# Altium project B155AA.PrjPcb
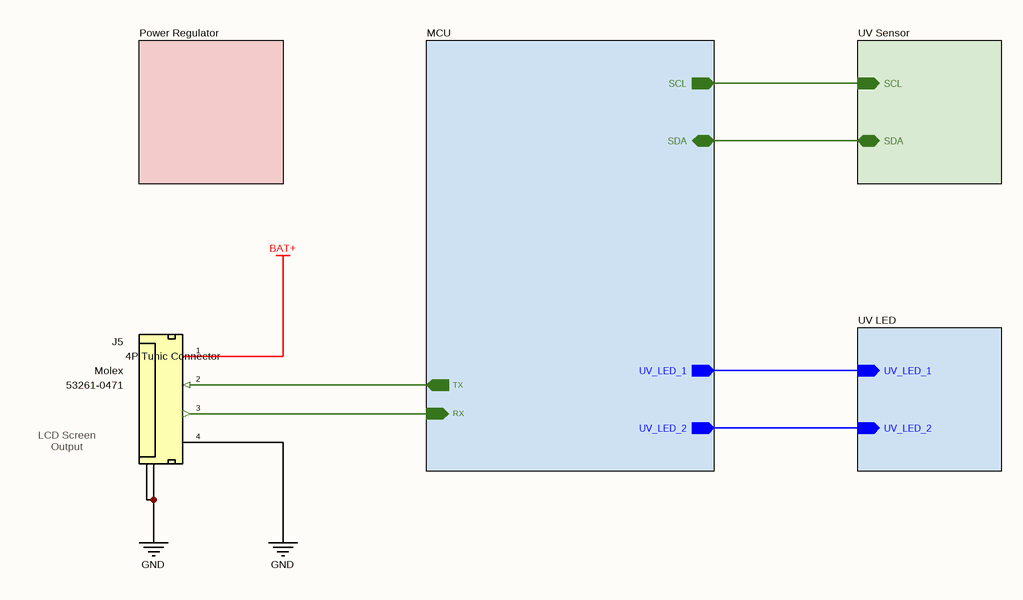
[diagram p0: B155AA.SchDoc]
5 sheets, 27 parts. Net scope: hierarchical (ports join the sheet entries above them; power ports are global).
Board file: B155AA.PcbDoc
Sheets:
  B155AA.SchDoc
    MCU = MCU.SchDoc
    UV Sensor = UV Sensor.SchDoc
    UV LED = UV LED.SchDoc
    Power Regulator = 3V3 Regulator.SchDoc

## Sheet B155AA.SchDoc: B155AA
size 292 x 193 mm; SheetNumber: 1; SheetTotal: 5

### Parts
J5  Manufacturer Name: Molex  Manufacturer Part Number: 53261-0471  [Connector_Tunic 4P]  (hidden comment: 4P SMD Tunic Connector)

### Sub-sheets
MCU = MCU.SchDoc: SCL (out), SDA (bidir), UV_LED_1 (out), UV_LED_2 (out), RX (in), TX (out)
Power Regulator = 3V3 Regulator.SchDoc: no entries
UV LED = UV LED.SchDoc: UV_LED_1 (in), UV_LED_2 (in)
UV Sensor = UV Sensor.SchDoc: SCL (in), SDA (bidir)

### Nets
BAT+: J5.1(BAT+)
GND: J5.4(BAT-) J5.5(GND) J5.6(GND)
RX: J5.3(RX) ; sheet MCU/RX
SCL: sheet MCU/SCL, sheet UV Sensor/SCL
SDA: sheet MCU/SDA, sheet UV Sensor/SDA
TX: J5.2(TX) ; sheet MCU/TX
UV_LED_1: sheet MCU/UV_LED_1, sheet UV LED/UV_LED_1
UV_LED_2: sheet MCU/UV_LED_2, sheet UV LED/UV_LED_2

### Notes on the sheet
- (near J5) LCD Screen Output
- © 2022 All rights reserved.
  This document may not, in whole or in part, be copied, photocopied, reproduced, translated or converted to any electronic or machine readable from without prior written permission of Mehmet Günce Akkoyun.
  Engineer contact : akkoyun@me.com
- Property of
- Engineer :
- Date :
- Size :
- A4
- Time :
- Project :
- Page :
- /
- Customer :
- Product ID :
- Module ID :
- Version :
- File :
- Revision :
- (in symbol Connector - Mini Tunic 4P (1.25)) 4P Tunic Connector

### Library data of the parts
J5 = Connector - Mini Tunic 4P (1.25): Mini Tunic Connector with 4P; Pitch: 1.25mm; Position: 4; ROHS: Yes; ComponentLink1Description: DataSheet; ComponentLink1URL: https://www.mouser.com.tr/datasheet/2/276/0532610471_PCB_HEADERS-170942.pdf; ComponentLink2Description: Mouser; ComponentLink2URL: https://www.mouser.com.tr/ProductDetail/Molex/53261-0471?qs=%2Fha2pyFaduhLhIsk8tywtK7BwWtguBSP4XxyDBTOTfs%3D; Case: SMD

## Sheet MCU.SchDoc: MCU
size 292 x 193 mm; SheetNumber: 3; SheetTotal: 5
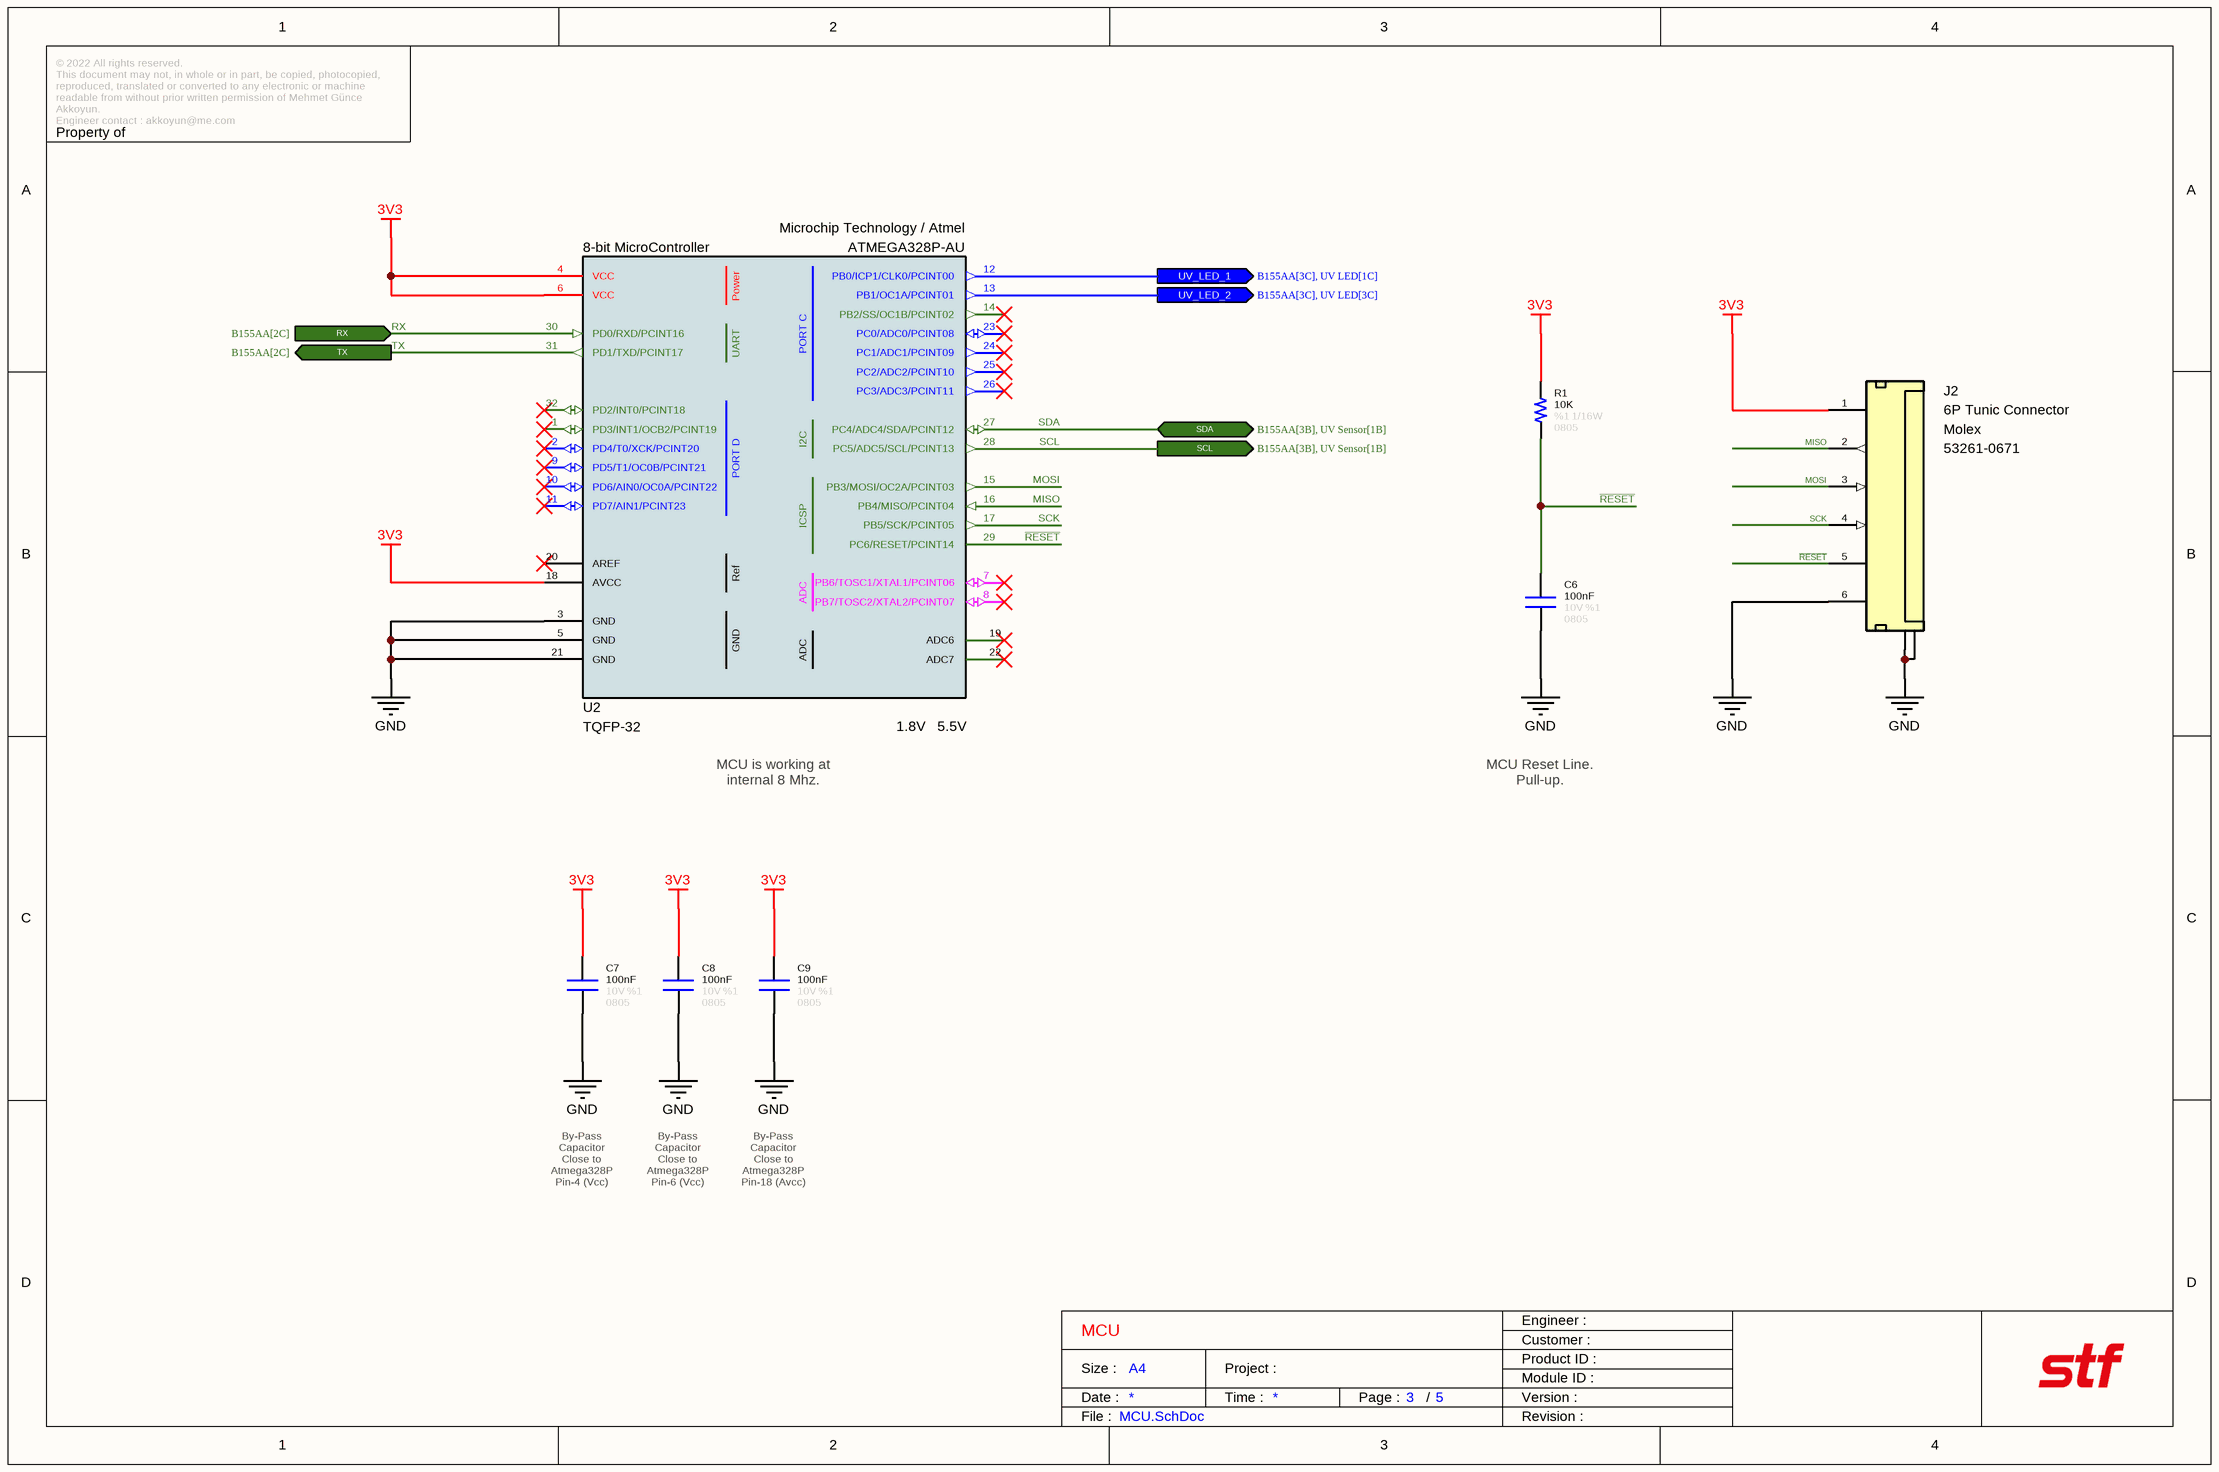
[diagram p1: MCU.SchDoc]

### Parts
C6  value 100nF  Tolerance: %1  Voltage: 10V  Case: 0805  [CAPACITOR_0805]  (hidden comment: Capacitor - 100nF [0805] (MLCC))
C7  value 100nF  Tolerance: %1  Voltage: 10V  Case: 0805  [CAPACITOR_0805]  (hidden comment: Capacitor - 100nF [0805] (MLCC))
C8  value 100nF  Tolerance: %1  Voltage: 10V  Case: 0805  [CAPACITOR_0805]  (hidden comment: Capacitor - 100nF [0805] (MLCC))
C9  value 100nF  Tolerance: %1  Voltage: 10V  Case: 0805  [CAPACITOR_0805]  (hidden comment: Capacitor - 100nF [0805] (MLCC))
J2  6P Tunic Connector  Manufacturer Part Number: 53261-0671  Manufacturer Name: Molex  [Connector_Tunic 6P]
R1  value 10K  Tolerance: %1  Case: 0805  Power: 1/16W  [RESISTOR_0805]  (hidden comment: 10K - 0805 - %1 - 1/16W)
U2  8-bit MicroController  Supply Voltage - Max: 5.5V  Supply Voltage - Min: 1.8V  Manufacturer Name: Microchip Technology / Atmel  Manufacturer Part Number: ATMEGA328P-AU  Case: TQFP-32  [TQFN-32]

### Ports
RX (in, see B155AA[2C]), SCL (out, see B155AA[3B], UV Sensor[1B]), SDA (bidir, see B155AA[3B], UV Sensor[1B]), TX (out, see B155AA[2C]), UV_LED_1 (out, see B155AA[3C], UV LED[1C]), UV_LED_2 (out, see B155AA[3C], UV LED[3C])

### Nets
3V3: C7.2 C8.2 C9.2 J2.1(VBAT) R1.2 U2.4(VCC) U2.6(VCC) U2.18(AVCC)
GND: C6.1 C7.1 C8.1 C9.1 J2.6(M_DRV) J2.7(GND) J2.8(GND) U2.3(GND) U2.5(GND) U2.21(GND)
MISO: J2.2(M_DRV) U2.16(PB4/MISO/PCINT04)
MOSI: J2.3(M_DRV) U2.15(PB3/MOSI/OC2A/PCINT03)
~{RESET}: C6.2 J2.5(M_DRV) R1.1 U2.29(PC6/RESET/PCINT14)
RX: U2.30(PD0/RXD/PCINT16) ; port RX
SCK: J2.4(M_DRV) U2.17(PB5/SCK/PCINT05)
SCL: U2.28(PC5/ADC5/SCL/PCINT13) ; port SCL
SDA: U2.27(PC4/ADC4/SDA/PCINT12) ; port SDA
TX: U2.31(PD1/TXD/PCINT17) ; port TX
UV_LED_1: U2.12(PB0/ICP1/CLK0/PCINT00) ; port UV_LED_1
UV_LED_2: U2.13(PB1/OC1A/PCINT01) ; port UV_LED_2

Not connected (* = marked no-connect by the designer): U2 1(PD3/INT1/OCB2/PCINT19)* 2(PD4/T0/XCK/PCINT20)* 7(PB6/TOSC1/XTAL1/PCINT06)* 8(PB7/TOSC2/XTAL2/PCINT07)* 9(PD5/T1/OC0B/PCINT21)* 10(PD6/AIN0/OC0A/PCINT22)* 11(PD7/AIN1/PCINT23)* 14(PB2/SS/OC1B/PCINT02)* 19(ADC6)* 20(AREF)* 22(ADC7)* 23(PC0/ADC0/PCINT08)* 24(PC1/ADC1/PCINT09)* 25(PC2/ADC2/PCINT10)* 26(PC3/ADC3/PCINT11)* 32(PD2/INT0/PCINT18)*

### Notes on the sheet
- MCU is working at internal 8 Mhz.
- MCU Reset Line. Pull-up.
- By-Pass Capacitor
  Close to Atmega328P
  Pin-4 (Vcc)
- By-Pass Capacitor
  Close to Atmega328P
  Pin-6 (Vcc)
- By-Pass Capacitor
  Close to Atmega328P
  Pin-18 (Avcc)
- © 2022 All rights reserved.
  This document may not, in whole or in part, be copied, photocopied, reproduced, translated or converted to any electronic or machine readable from without prior written permission of Mehmet Günce Akkoyun.
  Engineer contact : akkoyun@me.com
- Property of
- Engineer :
- Date :
- Size :
- A4
- Time :
- Project :
- Page :
- /
- Customer :
- Product ID :
- Module ID :
- Version :
- File :
- Revision :
- (in symbol IC - ATMEGA328P-AU) Power; PORT C; UART; I2C; PORT D; ICSP; Ref; ADC

### Library data of the parts
C6-C9 = Capacitor - 100nF [0805-10V]: Capacitor (MLCC) - 100nF / 10V / 0805; Manufacturer Name: KEMET; Manufacturer Part Number: C0805C104K8JACAUTO; Subcategory: Capacitors
J2 = Connector - Mini Tunic 6P (1.25): Mini Tunic Connector with 6P; ROHS: Yes
R1 = Resistor - 10K [0805]: Thick Film Resistors - SMD 1/16 W 10 KOhm 1%; Manufacturer Name: Vishay; Manufacturer Part Number: CRCW040210K0FKED; ComponentLink1Description: DataSheet; ComponentLink1URL: https://www.mouser.com.tr/datasheet/2/427/dcrcwe3-1762152.pdf; ComponentLink2Description: Mouser; ComponentLink2URL: https://www.mouser.com.tr/ProductDetail/Vishay-Dale/CRCW040210K0FKED?qs=sGAEpiMZZMu61qfTUdNhG2DpbjADlD3GcalbOv9utCY%3D
U2 = IC - ATMEGA328P-AU: 8-bit Microcontrollers - MCU 32KB In-system Flash 20MHz 1.8V-5.5V; Height: 1mm; ComponentLink1Description: DataSheet; ComponentLink1URL: http://ww1.microchip.com/downloads/en/DeviceDoc/ATmega48A-PA-88A-PA-168A-PA-328-P-DS-DS40002061A.pdf; ROHS: Yes; Minimum Operating Temperature: -40; Maximum Operating Temperature: +85; ComponentLink2Description: Mouser; ComponentLink2URL: https://www.mouser.com.tr/ProductDetail/Microchip-Technology-Atmel/ATMEGA328P-AU?qs=sGAEpiMZZMtVoztFdqDXO3RbBx7FKCmV; ComponentLink3Description: ProductPage; ComponentLink3URL: https://www.microchip.com/wwwproducts/en/ATmega328p

## Sheet UV Sensor.SchDoc: UV Sensor
size 292 x 193 mm; SheetNumber: 4; SheetTotal: 5
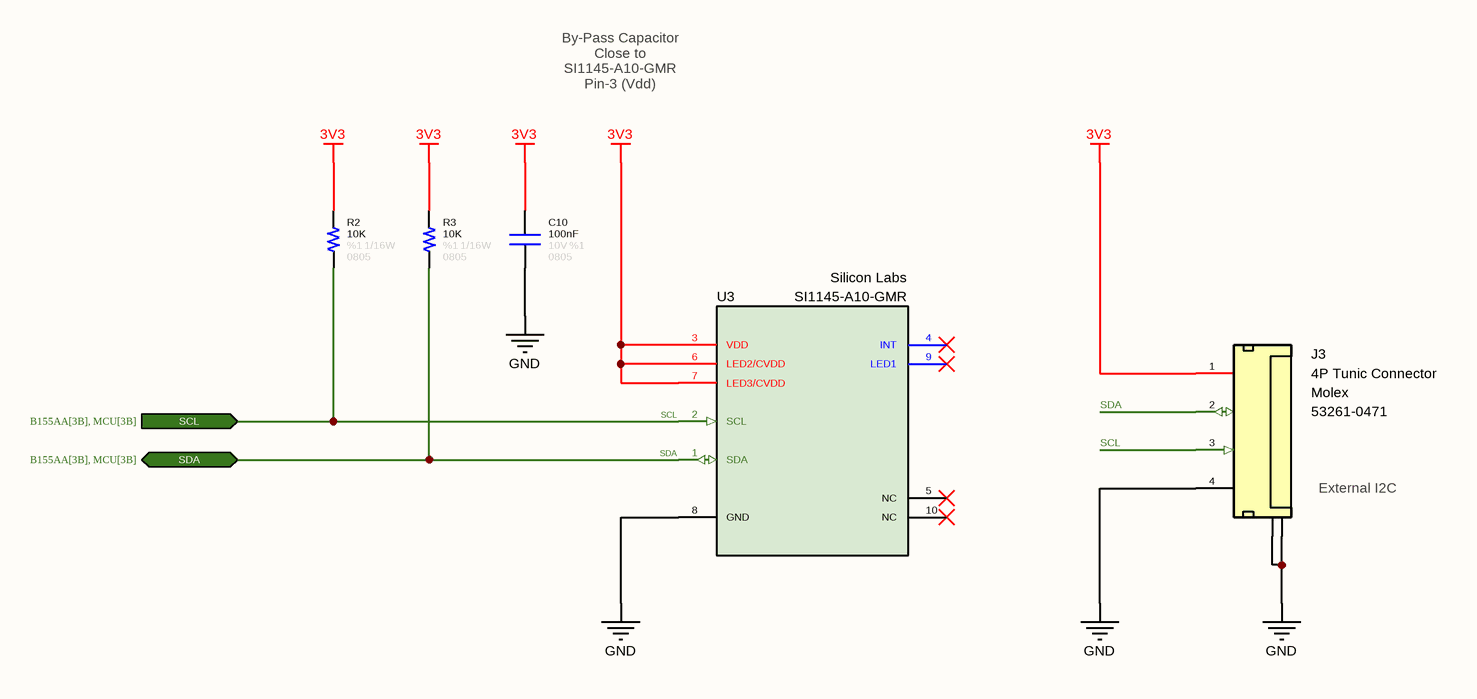
[diagram p2: UV Sensor.SchDoc]

### Parts
C10  value 100nF  Tolerance: %1  Voltage: 10V  Case: 0805  [CAPACITOR_0805]  (hidden comment: Capacitor - 100nF [0805] (MLCC))
J3  Manufacturer Name: Molex  Manufacturer Part Number: 53261-0471  [Connector_Tunic 4P]  (hidden comment: 4P SMD Tunic Connector)
R2  value 10K  Tolerance: %1  Case: 0805  Power: 1/16W  [RESISTOR_0805]  (hidden comment: 10K - 0805 - %1 - 1/16W)
R3  value 10K  Tolerance: %1  Case: 0805  Power: 1/16W  [RESISTOR_0805]  (hidden comment: 10K - 0805 - %1 - 1/16W)
U3  Manufacturer Name: Silicon Labs  [SI1145]  (hidden comment: Si1145-A10-GMR)

### Ports
SCL (in, see B155AA[3B], MCU[3B]), SDA (bidir, see B155AA[3B], MCU[3B])

### Nets
3V3: C10.2 J3.1(3V3) R2.2 R3.2 U3.3(VDD) U3.6(LED2/CVDD) U3.7(LED3/CVDD)
GND: C10.1 J3.4(GND) J3.5(GND) J3.6(GND) U3.8(GND)
SCL: J3.3(SCL) R2.1 U3.2(SCL) ; port SCL
SDA: J3.2(SDA) R3.1 U3.1(SDA) ; port SDA

Not connected (* = marked no-connect by the designer): U3 4(INT)* 5(NC)* 9(LED1)* 10(NC)*

### Notes on the sheet
- By-Pass Capacitor
  Close to SI1145-A10-GMR
  Pin-3 (Vdd)
- (near J3) External I2C
- © 2022 All rights reserved.
  This document may not, in whole or in part, be copied, photocopied, reproduced, translated or converted to any electronic or machine readable from without prior written permission of Mehmet Günce Akkoyun.
  Engineer contact : akkoyun@me.com
- Property of
- Engineer :
- Date :
- Size :
- A4
- Time :
- Project :
- Page :
- /
- Customer :
- Product ID :
- Module ID :
- Version :
- File :
- Revision :
- (in symbol Connector - Mini Tunic 4P (1.25)) 4P Tunic Connector

### Library data of the parts
C10 = Capacitor - 100nF [0805-10V]: as C6 on sheet MCU; Subcategory: Capacitors
J3 = Connector - Mini Tunic 4P (1.25): as J5 on sheet B155AA; ROHS: Yes; ComponentLink1Description: DataSheet; ComponentLink1URL: https://www.mouser.com.tr/datasheet/2/276/0532610471_PCB_HEADERS-170942.pdf; ComponentLink2Description: Mouser; ComponentLink2URL: https://www.mouser.com.tr/ProductDetail/Molex/53261-0471?qs=%2Fha2pyFaduhLhIsk8tywtK7BwWtguBSP4XxyDBTOTfs%3D; Case: SMD
R2 R3 = Resistor - 10K [0805]: as R1 on sheet MCU; ComponentLink1Description: DataSheet; ComponentLink1URL: https://www.mouser.com.tr/datasheet/2/427/dcrcwe3-1762152.pdf; ComponentLink2Description: Mouser; ComponentLink2URL: https://www.mouser.com.tr/ProductDetail/Vishay-Dale/CRCW040210K0FKED?qs=sGAEpiMZZMu61qfTUdNhG2DpbjADlD3GcalbOv9utCY%3D
U3 = IC - Si1145-A10-GMR: Proximity Sensors I2C UV Index and Proximity/Ambient Light Sensor with 1 LED Driver; Case: QFN-10; RoHS: Yes; Manufacturer Part Number: SI1145-A10-GMR

## Sheet UV LED.SchDoc: UV LED
size 292 x 193 mm; SheetNumber: 5; SheetTotal: 5
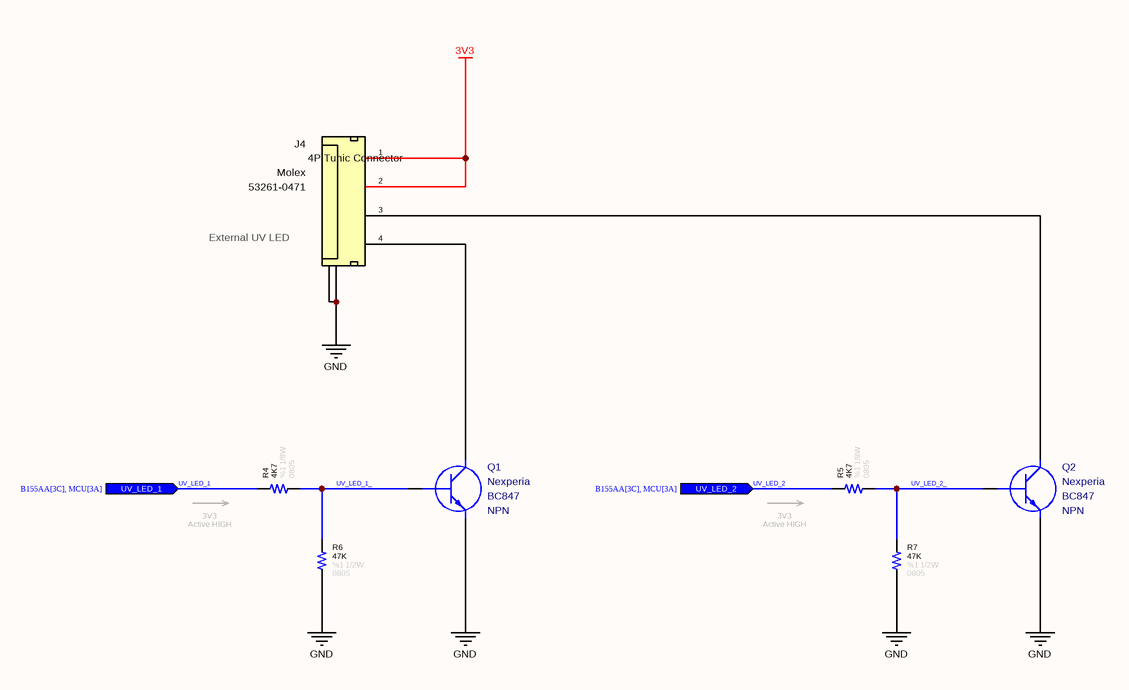
[diagram p3: UV LED.SchDoc]

### Parts
J4  Manufacturer Name: Molex  Manufacturer Part Number: 53261-0471  [Connector_Tunic 4P]  (hidden comment: 4P SMD Tunic Connector)
Q1  Manufacturer Name: Nexperia  Manufacturer Part Number: BC847  Polarity: NPN  [SOT-23-3]  (hidden comment: BC847AQAZ)
Q2  Manufacturer Name: Nexperia  Manufacturer Part Number: BC847  Polarity: NPN  [SOT-23-3]  (hidden comment: BC847AQAZ)
R4  value 4K7  Tolerance: %1  Case: 0805  Power: 1/8W  [RESISTOR_0805]  (hidden comment: 4K7 - 0805 - %1 - 1/16W)
R5  value 4K7  Tolerance: %1  Case: 0805  Power: 1/8W  [RESISTOR_0805]  (hidden comment: 4K7 - 0805 - %1 - 1/16W)
R6  value 47K  Tolerance: %1  Case: 0805  Power: 1/2W  [RESISTOR_0805]  (hidden comment: 47K - 0805 - %1 - 1/2W)
R7  value 47K  Tolerance: %1  Case: 0805  Power: 1/2W  [RESISTOR_0805]  (hidden comment: 47K - 0805 - %1 - 1/2W)

### Ports
UV_LED_1 (in, see B155AA[3C], MCU[3A]), UV_LED_2 (in, see B155AA[3C], MCU[3A])

### Nets
3V3: J4.1(BAT+) J4.2(BAT+)
GND: J4.5(GND) J4.6(GND) Q1.2(E) Q2.2(E) R6.1 R7.1
UV_LED_1: R4.2 ; port UV_LED_1
UV_LED_1_: Q1.1(B) R4.1 R6.2
UV_LED_2: R5.2 ; port UV_LED_2
UV_LED_2_: Q2.1(B) R5.1 R7.2
NetJ4_3: J4.3(BAT-) Q2.3(C)
NetJ4_4: J4.4(BAT-) Q1.3(C)

### Notes on the sheet
- (near J4) External UV LED
- (near R4) 3V3
  Active HIGH
- (near R5) 3V3
  Active HIGH
- © 2022 All rights reserved.
  This document may not, in whole or in part, be copied, photocopied, reproduced, translated or converted to any electronic or machine readable from without prior written permission of Mehmet Günce Akkoyun.
  Engineer contact : akkoyun@me.com
- Property of
- Engineer :
- Date :
- Size :
- A4
- Time :
- Project :
- Page :
- /
- Customer :
- Product ID :
- Module ID :
- Version :
- File :
- Revision :
- (in symbol Connector - Mini Tunic 4P (1.25)) 4P Tunic Connector

### Library data of the parts
J4 = Connector - Mini Tunic 4P (1.25): as J5 on sheet B155AA; ROHS: Yes; ComponentLink1Description: DataSheet; ComponentLink1URL: https://www.mouser.com.tr/datasheet/2/276/0532610471_PCB_HEADERS-170942.pdf; ComponentLink2Description: Mouser; ComponentLink2URL: https://www.mouser.com.tr/ProductDetail/Molex/53261-0471?qs=%2Fha2pyFaduhLhIsk8tywtK7BwWtguBSP4XxyDBTOTfs%3D; Case: SMD
Q1 Q2 = Transistor - BC847 (SOT23-3): Bipolar NPN Transistors; Case: SOT23-3
R4 R5 = Resistor - 4K7 [0805]: Thick Film Resistors - SMD 1/16 W 4.7 KOhm 1%; Manufacturer Name: Vishay; Manufacturer Part Number: CRCW08054K70FKEC; ComponentLink1Description: DataSheet; ComponentLink1URL: https://www.mouser.com.tr/datasheet/2/427/dcrcwe3-1762152.pdf; ComponentLink2Description: Mouser; ComponentLink2URL: https://www.mouser.com.tr/ProductDetail/Vishay-Dale/CRCW04024K70FKED?qs=sGAEpiMZZMu61qfTUdNhG7nHf%2F6MTUn3HadIdDQu24Q%3D
R6 R7 = Resistor - 47K [0805]: Thick Film Resistors - SMD 1/2 W 47 KOhm 1%; Manufacturer Name: Vishay; Manufacturer Part Number: CRCW080547K0FKECHP

## Sheet 3V3 Regulator.SchDoc: Power Segment
size 292 x 193 mm; SheetNumber: 2; SheetTotal: 5
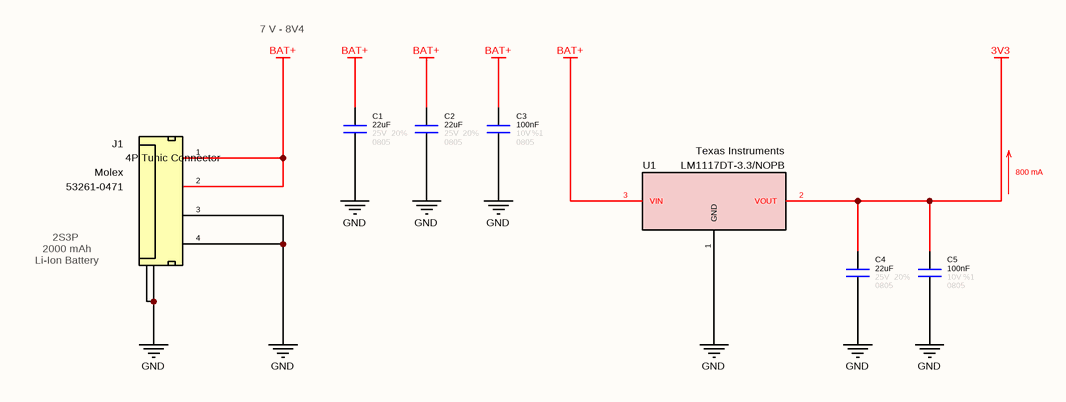
[diagram p4: 3V3 Regulator.SchDoc]

### Parts
C1  value 22uF  Tolerance: 20%  Case: 0805  Voltage: 25V  [CAPACITOR_0805]  (hidden comment: Capacitor - 22uF [1210] (Ceramic))
C2  value 22uF  Tolerance: 20%  Case: 0805  Voltage: 25V  [CAPACITOR_0805]  (hidden comment: Capacitor - 22uF [1210] (Ceramic))
C3  value 100nF  Tolerance: %1  Voltage: 10V  Case: 0805  [CAPACITOR_0805]  (hidden comment: Capacitor - 100nF [0805] (MLCC))
C4  value 22uF  Tolerance: 20%  Case: 0805  Voltage: 25V  [CAPACITOR_0805]  (hidden comment: Capacitor - 22uF [1210] (Ceramic))
C5  value 100nF  Tolerance: %1  Voltage: 10V  Case: 0805  [CAPACITOR_0805]  (hidden comment: Capacitor - 100nF [0805] (MLCC))
J1  Manufacturer Name: Molex  Manufacturer Part Number: 53261-0471  [Connector_Tunic 4P]  (hidden comment: 4P SMD Tunic Connector)
U1  Manufacturer Part Number: LM1117DT-3.3/NOPB  Manufacturer Name: Texas Instruments  [TO-252]  (hidden comment: LDO Regulator)

### Nets
3V3: C4.2 C5.2 U1.2(VOUT)
BAT+: C1.2 C2.2 C3.2 J1.1(BAT+) J1.2(BAT+) U1.3(VIN)
GND: C1.1 C2.1 C3.1 C4.1 C5.1 J1.3(BAT-) J1.4(BAT-) J1.5(GND) J1.6(GND) U1.1(GND)

### Notes on the sheet
- 7 V - 8V4
- 800 mA
- (near J1) 2S3P
  2000 mAh
  Li-Ion Battery
- © 2022 All rights reserved.
  This document may not, in whole or in part, be copied, photocopied, reproduced, translated or converted to any electronic or machine readable from without prior written permission of Mehmet Günce Akkoyun.
  Engineer contact : akkoyun@me.com
- Property of
- Engineer :
- Date :
- Size :
- A4
- Time :
- Project :
- Page :
- /
- Customer :
- Product ID :
- Module ID :
- Version :
- File :
- Revision :
- (in symbol Connector - Mini Tunic 4P (1.25)) 4P Tunic Connector

### Library data of the parts
C1 C2 C4 = Capacitor - 22uF [0805-25V]: Multilayer Ceramic Capacitors MLCC - SMD/SMT 22UF 25V 10% 1210; Manufacturer Part Number: GRM21BR61E226ME44L; Manufacturer Name: Murata
C3 C5 = Capacitor - 100nF [0805-10V]: as C6 on sheet MCU; Subcategory: Capacitors
J1 = Connector - Mini Tunic 4P (1.25): as J5 on sheet B155AA; ROHS: Yes; ComponentLink1Description: DataSheet; ComponentLink1URL: https://www.mouser.com.tr/datasheet/2/276/0532610471_PCB_HEADERS-170942.pdf; ComponentLink2Description: Mouser; ComponentLink2URL: https://www.mouser.com.tr/ProductDetail/Molex/53261-0471?qs=%2Fha2pyFaduhLhIsk8tywtK7BwWtguBSP4XxyDBTOTfs%3D; Case: SMD
U1 = IC - LM1117DT-3.3/NOPB: LDO Voltage Regulators 800MA LDO LINEAR REG; Case: TO-252-3

## Nets that join several sheets
3V3: MCU (8 pins), UV Sensor (7 pins), UV LED (J4.1 J4.2), 3V3 Regulator (C4.2 C5.2 U1.2)
BAT+: B155AA (J5.1), 3V3 Regulator (6 pins)
GND: B155AA (J5.4 J5.5 J5.6), MCU (10 pins), UV Sensor (5 pins), UV LED (6 pins), 3V3 Regulator (10 pins)
RX: B155AA (J5.3), MCU (U2.30)
SCL: MCU (U2.28), UV Sensor (J3.3 R2.1 U3.2)
SDA: MCU (U2.27), UV Sensor (J3.2 R3.1 U3.1)
TX: B155AA (J5.2), MCU (U2.31)
UV_LED_1: MCU (U2.12), UV LED (R4.2)
UV_LED_2: MCU (U2.13), UV LED (R5.2)